# EAGLE design sxbp-169 (EAGLE 8.0.0)
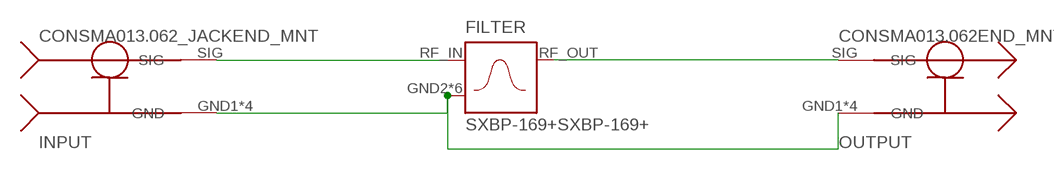
[diagram p0: schematic, sheet 1]

## Parts
FILTER  SXBP-169+SXBP-169+  [HF1139]
INPUT  CONSMA013.062_JACKEND_MNT  [SMA_EDGE_MNT]
OUTPUT  CONSMA013.062END_MNT  [SMA_EDGE_MNT]

## Nets
GND: FILTER.GND2(GND_IN) FILTER.GND3(GND_IN) FILTER.GND4(GND_IN) FILTER.GND5(GND_IN) FILTER.GND6(GND_IN) FILTER.GND7(GND_IN) INPUT.GND1(GND) INPUT.GND2(GND) INPUT.GND3(GND) INPUT.GND4(GND) OUTPUT.GND1(GND) OUTPUT.GND2(GND) OUTPUT.GND3(GND) OUTPUT.GND4(GND)
N$1: FILTER.RF_IN INPUT.SIG
N$3: FILTER.RF_OUT OUTPUT.SIG

## Library data of the parts
FILTER = balun:SXBP-169+
INPUT = balun:CONSMA013.062_JACK
OUTPUT = balun:CONSMA013.062

## Board
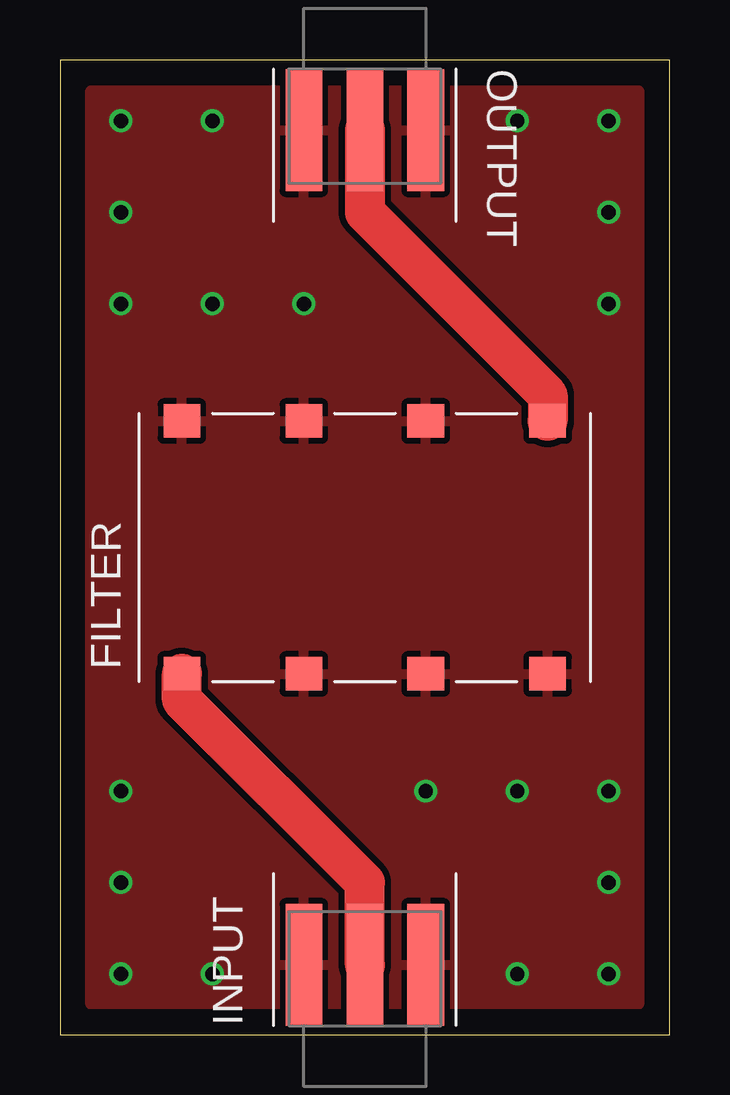
[diagram p1: board, top side]
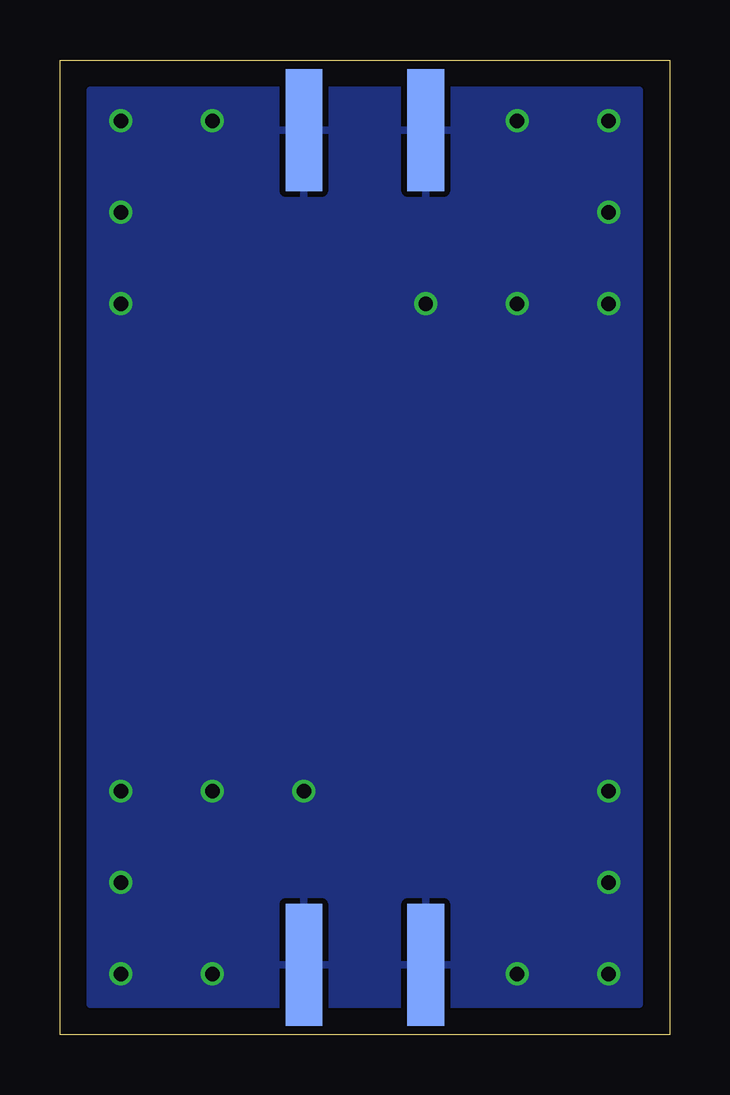
[diagram p2: board, bottom side, seen from below]

Size 25.4 x 40.64 mm. Coordinates in mm from the lower left corner, seen from the top.
Outline: 0,0 25.4,0 25.4,40.64 0,40.64 0,0
Copper layers (1*16): Top 0.0356mm / dielectric 1.5011mm / Bottom 0.0356mm
Design rules "LaenPCBOrder *": minimum track width 6mil, minimum drill 13mil, track to track 6mil, track to pad 6mil, pad to pad 6mil, via to via 6mil, smd to smd 6mil, copper to edge 15mil, drill to drill 6mil, minimum pad ring 7mil, minimum via ring 7mil, stop-mask expansion 3mil, vias tented up to drill 0mil, thermal gap 10mil

### Footprints (pad centres in the part's own frame; a part is rotated, then mirrored left to right if it is on the bottom)
HF1139 = smd 1.524 x 1.397: GND2 -7.62,5.271; GND3 -2.54,-5.271; GND4 -2.54,5.271; GND5 2.54,-5.271; GND6 2.54,5.271; GND7 7.62,-5.271; RF_IN -7.62,-5.271; RF_OUT 7.62,5.271
SMA_EDGE_MNT = smd 1.524 x 5.08 bottom: GND1 -2.54,0; GND2 2.54,0 | smd 1.524 x 5.08: GND3 -2.54,0; GND4 2.54,0; SIG 0,0

### Placement (x,y rotation side)
FILTER  12.7,20.32 0 top
INPUT  12.7,2.92 180 top
OUTPUT  12.7,37.72 0 top

### Tracks (layer width: path | path; a pad name or v marks a point on that pad's centre or on a via)
GND  (via drill 0.6)
  other vias: 2.54,38.1 2.54,34.29 2.54,30.48 6.35,30.48 6.35,38.1 10.16,30.48 19.05,38.1 22.86,38.1 22.86,34.29 22.86,30.48 2.54,10.16 2.54,6.35 2.54,2.54 6.35,2.54 15.24,10.16 19.05,10.16 19.05,2.54 22.86,2.54 22.86,6.35 22.86,10.16
  pour Bottom (isolate 0.254): 1.27,39.37 1.27,1.27 7.62,1.27 17.78,1.27 24.13,1.27 24.13,39.37 17.78,39.37 7.62,39.37
  pour Top (isolate 0.254): 1.27,39.37 24.13,39.37 24.13,1.27 1.27,1.27
N$1
  Top 1.676: INPUT.SIG 12.7,6.35 5.08,13.97 FILTER.RF_IN
N$3
  Top 1.676: OUTPUT.SIG 12.7,34.29 20.32,26.67 FILTER.RF_OUT